# Altium project Street_light_driver.PrjPcb
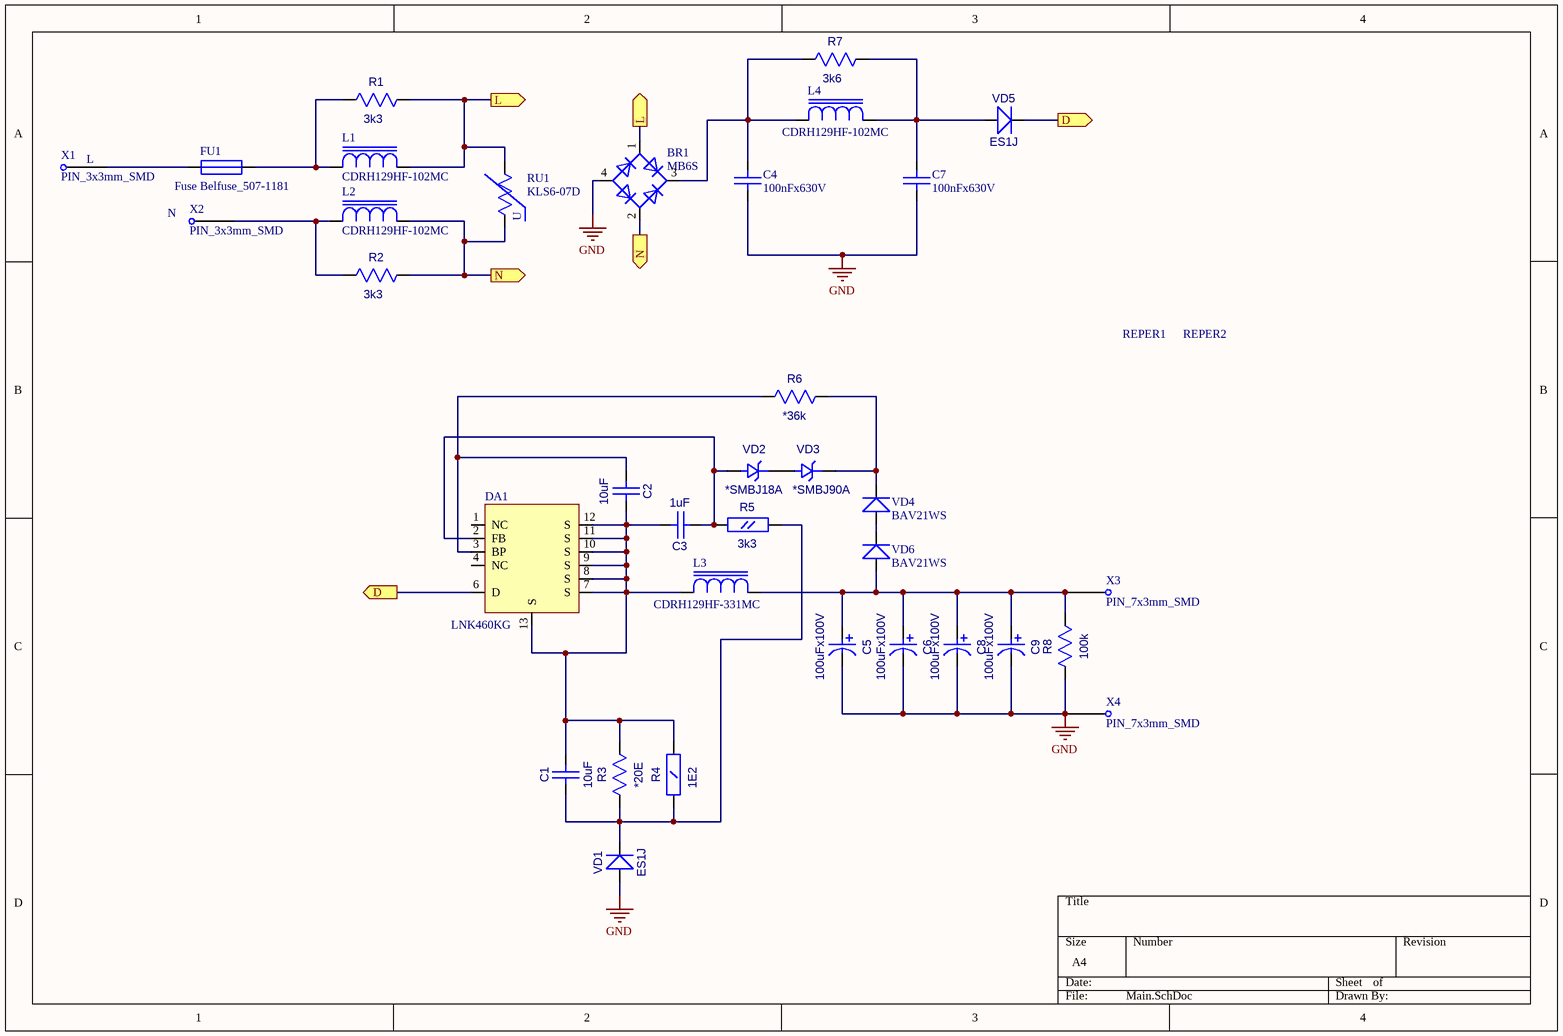
[diagram p0: Main.SchDoc]
1 sheet, 37 parts. Net scope: flat (ports and power ports of the same name join across sheets).
Board file: Street_light_driver.PcbDoc

## Sheet Main.SchDoc
size A4

### Parts
BR1  MB6S  [TO-269AA]
C1  10uF  [CC0805]
C2  10uF  [CC0805]
C3  1uF  [CC0805]
C4  100nFx630V  [CAP_630V_100NF]
C5  100uFx100V  [CAP_ELEC_10x21]
C6  100uFx100V  [CAP_ELEC_10x21]
C7  100nFx630V  [CAP_630V_100NF]
C8  100uFx100V  [CAP_ELEC_10x21]
C9  100uFx100V  [CAP_ELEC_10x21]
DA1  LNK460KG  [eSOP-12]
FU1  Fuse Belfuse_507-1181  [FUSE_BELLFUSE]
L1  CDRH129HF-102MC  [IND CDRH129]
L2  CDRH129HF-102MC  [IND CDRH129]
L3  CDRH129HF-331MC  [IND CDRH129]
L4  CDRH129HF-102MC  [IND CDRH129]
R1  3k3  [RC1206]
R2  3k3  [RC1206]
R3  *20E  [RC0805]
R4  1E2  [RC1206]
R5  3k3  [RC0805]
R6  *36k  [RC0603]
R7  3k6  [RC1206-2M]
R8  100k  [RC0805]
REPER1  REPER1.2  [REPER1.2]  (value not drawn)
REPER2  REPER1.2  [REPER1.2]  (value not drawn)
RU1  KLS6-07D  [Varistor_7mm]
VD1  ES1J  [SMA]
VD2  *SMBJ18A  [SMB]
VD3  *SMBJ90A  [SMB]
VD4  BAV21WS  [SOD-323]
VD5  ES1J  [SMA]
VD6  BAV21WS  [SOD-323]
X1  PIN_3x3mm_SMD  [PIN_3x3mm_SMD]
X2  PIN_3x3mm_SMD  [PIN_3x3mm_SMD]
X3  PIN_7x3mm_SMD  [PIN_7x3mm_SMD]
X4  PIN_7x3mm_SMD  [PIN_7x3mm_SMD]

### Ports
D (out), L (out), N (out)

### Nets
GND: BR1.4 C4.2(B) C5.2 C6.2 C7.2(B) C8.2 C9.2 R8.1(A) VD1.1(A) X4.1
NetBR1_1: BR1.1(C) L1.2(B) R1.2(B) RU1.2(B) ; port L
NetBR1_2: BR1.2(C) L2.2(B) R2.2(B) RU1.1(A) ; port N
NetBR1_3: BR1.3(K) C4.1(A) L4.1(A) R7.1(A)
NetC1_1: C1.1(A) R3.1(A) R4.1(A) R5.2(B) VD1.2(K)
NetC1_2: C1.2(B) C2.2(B) C3.2(B) DA1.7(S) DA1.8(S) DA1.9(S) DA1.10(S) DA1.11(S) DA1.12(S) DA1.13(S) L3.1(A) R3.2(B) R4.2(B)
NetC2_1: C2.1(A) DA1.3(BP) R6.1(A)
NetC3_1: C3.1(A) DA1.2(FB) R5.1(A) VD2.1(A)
NetC5_1: C5.1 C6.1 C8.1 C9.1 L3.2(B) R8.2(B) VD6.1(A) X3.1
NetC7_1: C7.1(A) L4.2(B) R7.2(B) VD5.1(A)
NetDA1_6: DA1.6(D) VD5.2(K) ; port D
NetFU1_1: FU1.1 X1.1
NetFU1_2: FU1.2 L1.1(A) R1.1(A)
NetL2_1: L2.1(A) R2.1(A) X2.1
NetR6_2: R6.2(B) VD3.2(K) VD4.2(K)
NetVD2_2: VD2.2(K) VD3.1(A)
NetVD4_1: VD4.1(A) VD6.2(K)

Not connected (* = marked no-connect by the designer): DA1 1(NC) 4(NC); REPER1 1; REPER2 1

### Notes on the sheet
- (near X1) L
- (near X2) N
- (in symbol Varistor_KLS6-07D431K) U
- (in symbol KLS6-07D) U

### Library data of the parts
C1-C3 = CC0805
  C1 C2: Value: 10uF
  C3: Value: 1uF
C4 C7 = Cap_HV: Value: 100nFx630V
C5 C6 C8 C9 = CAP0.5: Value: 100uFx100V
L1-L4 = IND CDRH129HF
  L1 L2 L4: Value: CDRH129HF-102MC
  L3: Value: CDRH129HF-331MC
R1 R2 R4 R7 = RC1206
  R1 R2: Value: 3k3
  R4: Value: 1E2
  R7: Value: 3k6
R3 R5 R8 = RC0805
  R3: Value: *20E
  R5: Value: 3k3
  R8: Value: 100k
R6 = RC0603: Value: *36k
RU1 = Varistor_KLS6-07D431K: Value: KLS6-07D
VD1 VD5 = SS14: Schottky Rectifier; Value: ES1J
VD2 VD3 = SMBJ
  VD2: Value: *SMBJ18A
  VD3: Value: *SMBJ90A
BR1 = MB6S: Value: MB6S
DA1 = LNK460KG: Value: LNK460KG
FU1 = Fuse Belfuse_507-1181: Value: Fuse Belfuse_507-1181
REPER1 REPER2 = REPER1.2: Value: *
VD4 VD6 = BAV21WS: Value: BAV21WS